# EAGLE design TwinSensorTestRevB (EAGLE 7.5.0)
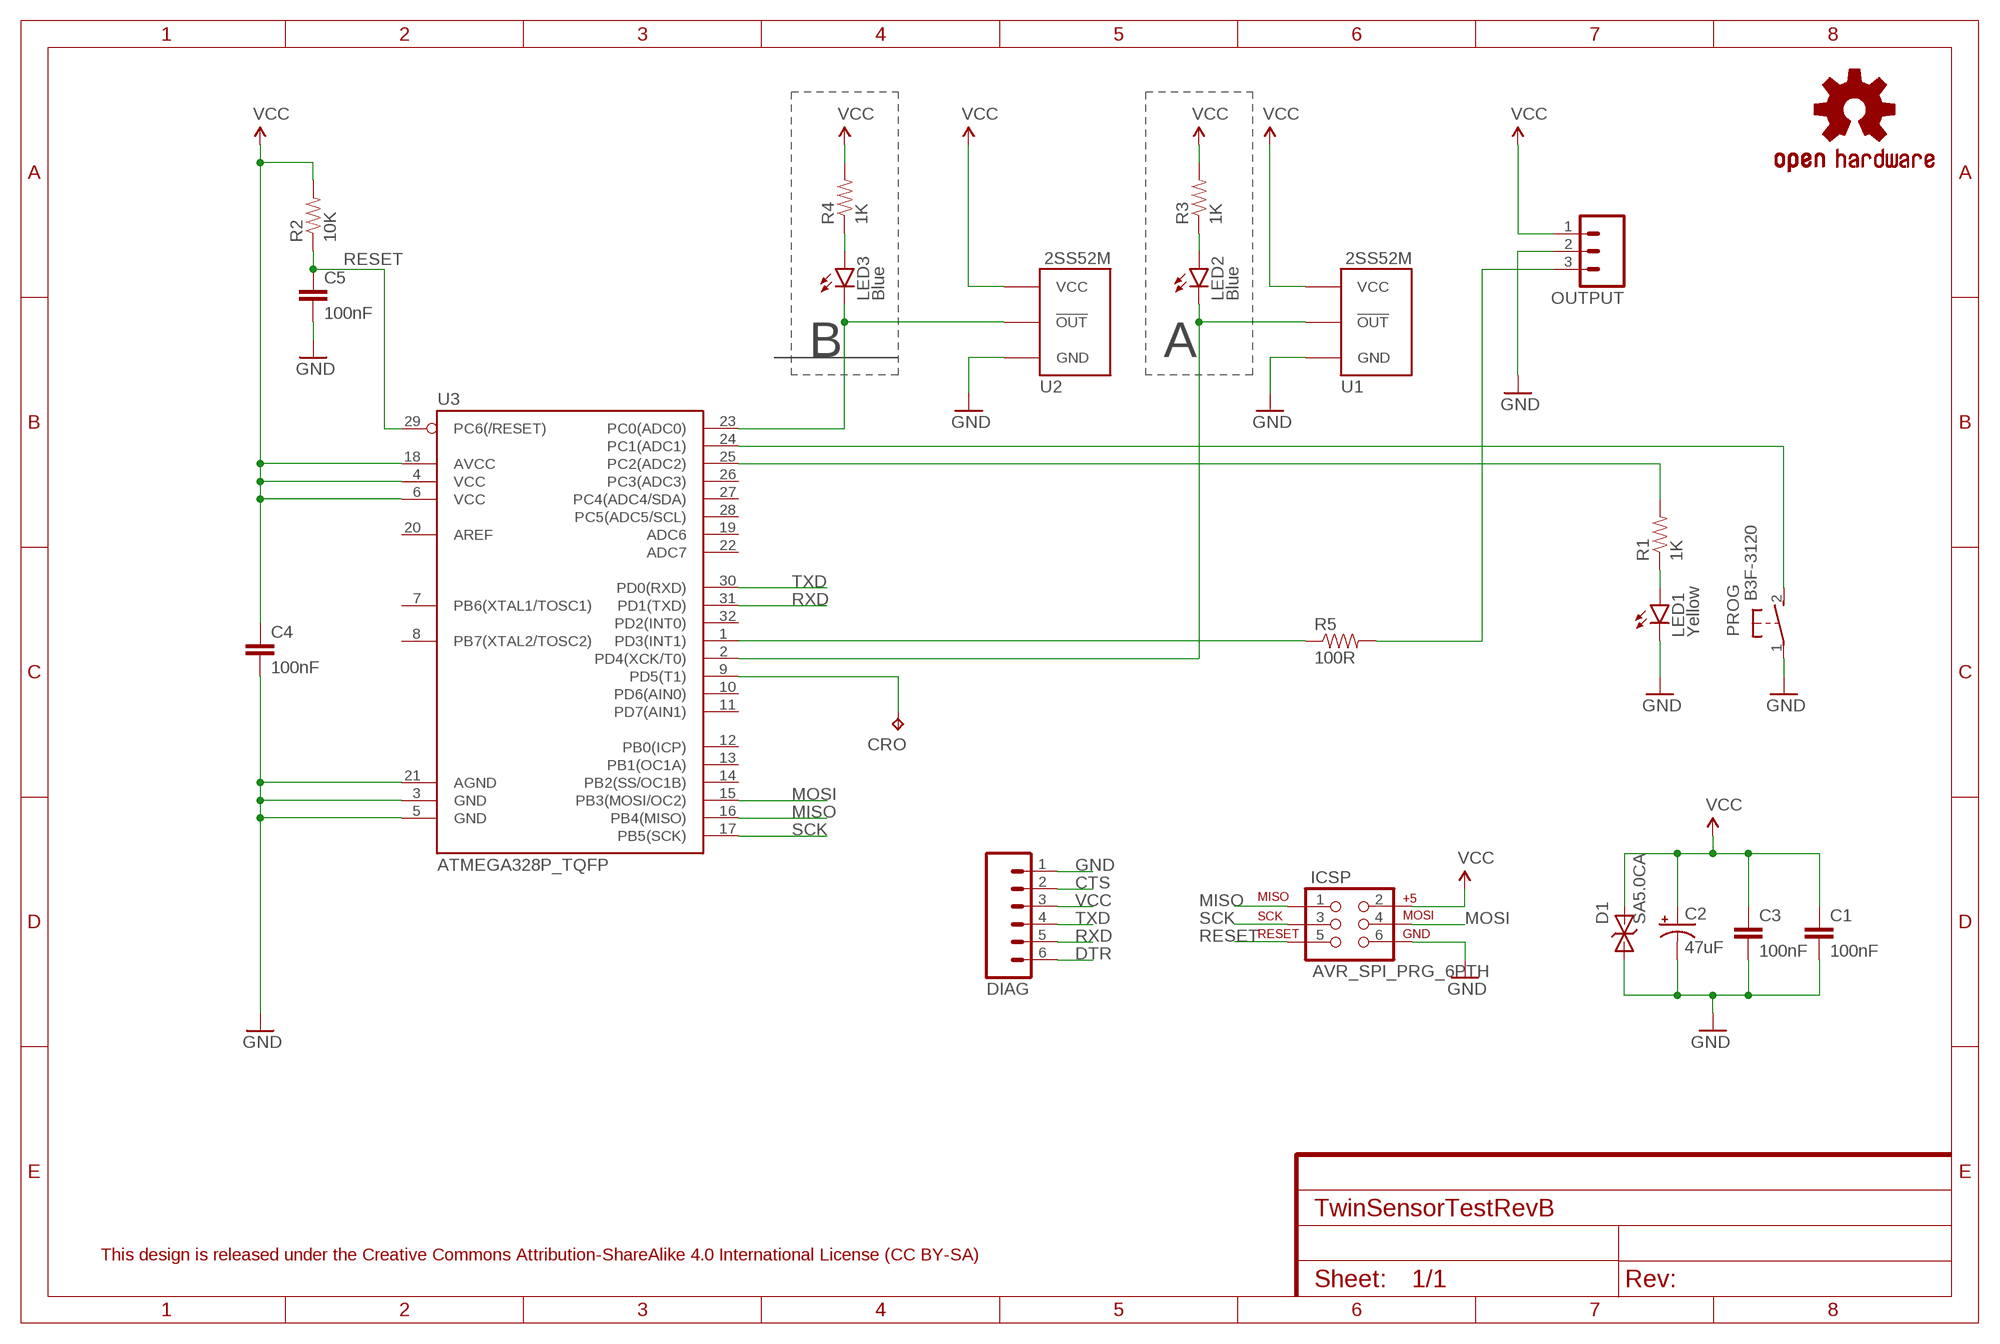
[diagram p0: schematic, sheet 1]
FRAME1 (FRAME-A4L): CNAME: Twin Sensor Test Board; CREVISION: B 05/2016; DESIGNER: Andrew Instone-Cowie

## Parts
C1  100nF  CAPPTH  [CAP-PTH-SMALL]
C2  47uF  CAP_POLPTH1  [CPOL-RADIAL-100UF-25V]
C3  100nF  CAPPTH  [CAP-PTH-SMALL]
C4  100nF  CAPPTH  [CAP-PTH-SMALL]
C5  100nF  CAPPTH  [CAP-PTH-SMALL]
CRO  TPTP10R  [TP10R]
D1  SA5.0CA  [DO41_TVS]
DIAG  M06SILK_FEMALE_PTH  [1X06]
ICSP  AVR_SPI_PRG_6PTH  [2X3]
LED1  Yellow  LED3MM  [LED3MM]
LED2  Blue  LED3MM  [LED3MM]
LED3  Blue  LED3MM  [LED3MM]
LOGO1  OSHW-LOGOS  [OSHW-LOGO-S]
OUTPUT  M03PTH  [1X03]
PROG  B3F-3120  [B3F-3120]
R1  1K  RESISTORPTH-1/4W  [AXIAL-0.4]
R2  10K  RESISTORPTH-1/4W  [AXIAL-0.4]
R3  1K  RESISTORPTH-1/4W  [AXIAL-0.4]
R4  1K  RESISTORPTH-1/4W  [AXIAL-0.4]
R5  100R  RESISTORPTH-1/4W  [AXIAL-0.4]
U1  2SS52MVERT  [2SS52M_VERT]
U2  2SS52MVERT  [2SS52M_VERT]
U3  ATMEGA328P_TQFP  [TQFP32-08]

## Nets
CTS: DIAG.2
DTR: DIAG.6
GND: C1.2 C2.2(-) C3.2 C4.2 C5.2 D1.A DIAG.1 ICSP.6 LED1.K(C) OUTPUT.2 PROG.1(P) U1.P$1(GND) U2.P$1(GND) U3.3(GND) U3.5(GND) U3.21(AGND)
MISO: ICSP.1 U3.16(PB4(MISO))
MOSI: ICSP.4 U3.15(PB3(MOSI/OC2))
N$1: LED2.A R3.P$1
N$2: LED3.A R4.P$1
N$3: R5.P$1 U3.1(PD3(INT1))
N$4: PROG.2(S) U3.24(PC1(ADC1))
N$5: R1.P$2 U3.25(PC2(ADC2))
N$6: LED1.A R1.P$1
N$7: LED2.K(C) U1.P$2(!OUT!) U3.2(PD4(XCK/T0))
N$8: LED3.K(C) U2.P$2(!OUT!) U3.23(PC0(ADC0))
N$9: CRO.TP U3.9(PD5(T1))
OUT: OUTPUT.3 R5.P$2
RESET: C5.1 ICSP.5 R2.P$1 U3.29(PC6(/RESET))
RXD: DIAG.5 U3.31(PD1(TXD))
SCK: ICSP.3 U3.17(PB5(SCK))
TXD: DIAG.4 U3.30(PD0(RXD))
VCC: C1.1 C2.1(+) C3.1 C4.1 D1.C DIAG.3 ICSP.2 OUTPUT.1 R2.P$2 R3.P$2 R4.P$2 U1.P$3(VCC) U2.P$3(VCC) U3.4(VCC) U3.6(VCC) U3.18(AVCC)
Unconnected: U3.7(PB6(XTAL1/TOSC1)) U3.8(PB7(XTAL2/TOSC2)) U3.10(PD6(AIN0)) U3.11(PD7(AIN1)) U3.12(PB0(ICP)) U3.13(PB1(OC1A)) U3.14(PB2(SS/OC1B)) U3.19(ADC6) U3.20(AREF) U3.22(ADC7) U3.26(PC3(ADC3)) U3.27(PC4(ADC4/SDA)) U3.28(PC5(ADC5/SCL)) U3.32(PD2(INT0))

## Notes on the sheet
- B | A
- This design is released under the Creative Commons Attribution-ShareAlike 4.0 International License (CC BY-SA)

## Library data of the parts
C1 C3-C5 = SparkFun-Passives:CAP: Capacitor Standard 0603 ceramic capacitor, and 0.1" leaded capacitor.
C2 = SparkFun-Passives:CAP_POL: Capacitor Polarized These are standard SMD and PTH capacitors. Normally 10uF, 47uF, and 100uF in electrolytic and tantalum varieties. Always verify the external diameter of the through hole cap, it varies with capacity, voltage, and manufacturer. The EIA devices should be standard.
CRO = testpad:TP: Test pad
D1 = AIC_Custom:SA5.0CA: SA5.0CA TVS Bi-Directional Transient Voltage Suppressor. 5V, DO41 package
DIAG = SparkFun-Connectors:M06: Header 6 Standard 6-pin 0.1" header. Use with straight break away headers (SKU : PRT-00116), right angle break away headers (PRT-00553), swiss pins (PRT-00743), machine pins (PRT-00117), and female headers (PRT-00115). Molex polarized connector foot print use with SKU : PRT-08094 with associated crimp pins and housings. NOTES ON THE VARIANTS LOCK and LOCK_LONGPADS... This footprint was designed to help hold the alignment of a through-hole component (i.e. 6-pin header) while soldering it into place. You may notice that each hole has been shifted either up or down by 0.005 of an inch from it's more standard position (which is a perfectly straight line). This slight alteration caused the pins (the squares in the middle) to touch the edges of the holes. Because they are alternating, it causes a "brace" to hold the component in place. 0.005 has proven to be the perfect amount of "off-center" position when using our standard breakaway headers. Although looks a little odd when you look at the bare footprint, once you have a header in there, the alteration is very hard to notice. Also,if you push a header all the way into place, it is covered up entirely on the bottom side. This idea of altering the position of holes to aid alignment will be further integrated into the Sparkfun Library for other footprints. It can help hold any component with 3 or more connection pins.; PROD_ID: CONN-08437
ICSP = SparkFun-Connectors:AVR_SPI_PRG_6: AVR ISP 6 Pin This is the reduced ISP connector for AVR programming. Common on Arduino. This footprint will take up less PCB space and can be used with a 10-pin to 6-pin adapter such as SKU: BOB-08508 **Special note about "TEST_POINT" package. The stop mask is on the top side, so if you want your programming test points to be on the bottom of your board, make sure to place this package on the bottom side of the board. This also ensure that the orientation to program from the bottom side will be correct.
LED1-LED3 = SparkFun-LED:LED: LEDs Standard schematic elements and footprints for 5mm, 3mm, 1206, and 0603 sized LEDs. 5mm - Spark Fun Electronics SKU : COM-00529 (and others)
LOGO1 = SparkFun-Aesthetics:OSHW-LOGO: Open Source Hardware Logo This logo indicates the piece of hardware it is found on incorporates a OSHW license and/or adheres to the definition of open source hardware found here: http://freedomdefined.org/OSHW
OUTPUT = SparkFun-Connectors:M03: Header 3 Standard 3-pin 0.1" header. Use with straight break away headers (SKU : PRT-00116), right angle break away headers (PRT-00553), swiss pins (PRT-00743), machine pins (PRT-00117), and female headers (PRT-00115). Molex polarized connector foot print use with SKU : PRT-08232 with associated crimp pins and housings.
PROG = AIC_Custom:B3F-3120: OMRON SWITCH; MPN: B3F-3100; OC_FARNELL: 959704; OC_NEWARK: 36M3582
R1-R5 = SparkFun-Passives:RESISTOR: Resistor Basic schematic elements and footprints for 0603, 1206, and PTH resistors.
U1 U2 = AIC_Custom:2SS52M: Honeywell 2SS52M Magnetoresistive Detector
U3 = SparkFun-DigitalIC:ATMEGA328P_TQFP; PROD_ID: IC-09069

## Board
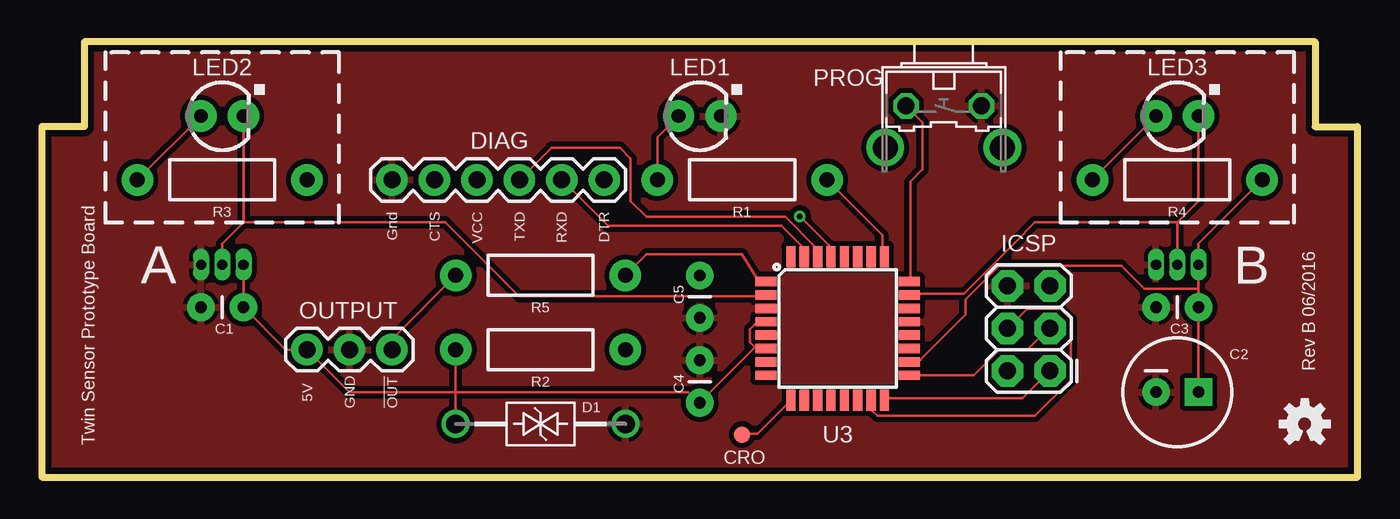
[diagram p1: board, top side]
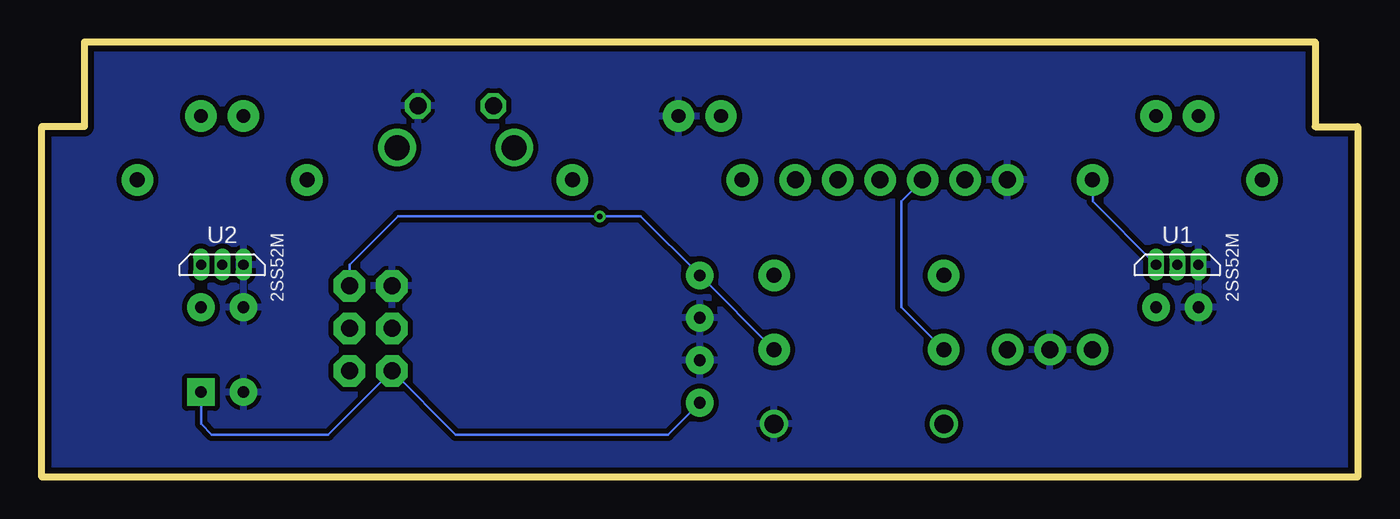
[diagram p2: board, bottom side, seen from below]

Size 78.74 x 26.04 mm. Coordinates in mm from the lower left corner, seen from the top.
Outline: 0,0 78.74,0 78.74,20.95 76.2,20.95 76.2,26.04 2.54,26.04 2.54,20.95 0,20.95 0,0
Copper layers (1*16): Top 0.0356mm / dielectric 1.5011mm / Bottom 0.0356mm
Design rules "LaenPCBOrder(OSHPARK)": minimum track width 6mil, minimum drill 13mil, track to track 6mil, track to pad 6mil, pad to pad 6mil, via to via 6mil, smd to smd 6mil, copper to edge 15mil, drill to drill 6mil, minimum pad ring 7mil, minimum via ring 7mil, stop-mask expansion 3mil, vias tented up to drill 0mil, thermal gap 10mil

### Footprints (pad centres in the part's own frame; a part is rotated, then mirrored left to right if it is on the bottom)
CAP-PTH-SMALL = drill 0.7 pad 1.651: 1 0,0; 2 2.54,0
CPOL-RADIAL-100UF-25V = drill 0.7 pad 1.651 square: 1 1.27,0 | drill 0.7 pad 1.651: 2 -1.27,0
TP10R = smd 1 x 1: TP 0,0
DO41_TVS = drill 1.118: A 5.08,0; C -5.08,0
1X06 = drill 1.016 pad 1.88: 1 0,0; 2 2.54,0; 3 5.08,0; 4 7.62,0; 5 10.16,0; 6 12.7,0
2X3 = drill 1.016 pad 1.88 octagon: 1 0,0; 2 0,2.54; 3 2.54,0; 4 2.54,2.54; 5 5.08,0; 6 5.08,2.54
LED3MM = drill 0.813 pad 1.88: A -1.27,0; K 1.27,0
1X03 = drill 1.016 pad 1.88: 1 0,0; 2 2.54,0; 3 5.08,0
B3F-3120 = drill 1.016 octagon: 1 -2.261,-1.245; 2 2.261,-1.245 | drill 1.499 pad 2.159: 3 -3.505,1.245; 4 3.505,1.245
AXIAL-0.4 = drill 0.9 pad 1.88: P$1 -5.08,0; P$2 5.08,0
2SS52M_VERT = drill 0.6 pad 0.813 long: P$1 0,1.27; P$2 0,0; P$3 0,-1.27
TQFP32-08 = smd 1.27 x 0.559: 1 -4.293,2.8; 2 -4.293,2; 3 -4.293,1.2; 4 -4.293,0.4; 5 -4.293,-0.4; 6 -4.293,-1.2; 7 -4.293,-2; 8 -4.293,-2.8; 17 4.293,-2.8; 18 4.293,-2; 19 4.293,-1.2; 20 4.293,-0.4; 21 4.293,0.4; 22 4.293,1.2; 23 4.293,2; 24 4.293,2.8 | smd 0.559 x 1.27: 9 -2.8,-4.293; 10 -2,-4.293; 11 -1.2,-4.293; 12 -0.4,-4.293; 13 0.4,-4.293; 14 1.2,-4.293; 15 2,-4.293; 16 2.8,-4.293; 25 2.8,4.293; 26 2,4.293; 27 1.2,4.293; 28 0.4,4.293; 29 -0.4,4.293; 30 -1.2,4.293; 31 -2,4.293; 32 -2.8,4.293

### Placement (x,y rotation side)
C1  12.06,10.16 180 top
C2  67.94,5.08 0 top
C3  69.22,10.16 180 top
C4  39.37,4.45 90 top
C5  39.37,12.06 270 top
CRO  41.91,2.54 0 top
D1  29.84,3.17 0 top
DIAG  20.95,17.78 0 top
ICSP  60.33,6.35 90 top
LED1  39.37,21.59 0 top
LED2  10.79,21.59 0 top
LED3  67.94,21.59 0 top
LOGO1  75.56,3.17 0 top
OUTPUT  15.88,7.62 0 top
PROG  53.98,20.95 180 top
R1  41.91,17.78 0 top
R2  29.84,7.62 180 top
R3  10.79,17.78 0 top
R4  67.94,17.78 0 top
R5  29.84,12.06 180 top
U1  10.79,12.7 270 bottom
U2  67.94,12.7 270 bottom
U3  47.62,8.89 0 top

### Tracks (layer width: path | path; a pad name or v marks a point on that pad's centre or on a via)
GND
  pour Bottom (isolate 0.305): 2.54,26.04 2.54,20.95 0,20.95 0,0 78.74,0 78.74,20.95 76.2,20.95 76.2,26.04
  pour Top (isolate 0.305): 2.54,26.04 2.54,20.95 0,20.95 0,0 78.74,0 78.74,20.95 76.2,20.95 76.2,26.04
MISO
  Top 0.152: U3.16 50.44,4.72 58.67,4.72 60.2,6.25 ICSP.1
MOSI
  Top 0.152: U3.15 49.68,4.57 49.68,3.96 49.99,3.66 59.44,3.66 61.57,5.79 61.57,9.45 60.96,10.06 58.98,10.06 57.91,8.99 ICSP.4
N$1
  Top 0.152: LED2.A R3.P$1
N$2
  Top 0.152: LED3.A R4.P$1
N$3
  Top 0.152: R5.P$1 36.2,13.34 41.91,13.34 42.92,11.69
  Top 0.406: 42.92,11.69 U3.1
N$4
  Top 0.152: U3.24 51.97,11.73 51.97,17.07 51.97,17.68 52.7,18.41 52.7,21.21 PROG.2
N$5
  Top 0.152: R1.P$2 50.29,14.48 50.29,13.26 U3.25
N$6
  Top 0.152: LED1.A 36.83,20.32 R1.P$1
N$7
  Top 0.152: U3.2 43.28,10.82 40.72,10.82 28.55,10.82 24.13,15.24 12.06,15.24 | LED2.K 12.06,15.24 | 12.06,15.24 10.79,13.97 U1.P$2
N$8
  Top 0.152: U3.23 51.97,10.97 55.17,10.97 58.22,14.02 59.44,15.24 67.94,15.24 | LED3.K 69.22,16.51 67.94,15.24 | 67.94,15.24 U2.P$2
N$9
  Top 0.152: CRO.TP 41.91,2.59 42.82,2.59 44.81,4.57 U3.9
OUT
  Top 0.152: R5.P$2 20.95,8.26 OUTPUT.3
RESET  (via drill 0.33)
  Top 0.152: v45.36,15.6 47.09,13.87 47.09,13.26 U3.29
  Bottom 0.152: R2.P$1 C5.1 42.9,15.6 v45.36,15.6 57.43,15.6 60.33,12.7 ICSP.5
RXD
  Top 0.152: U3.31 45.57,13.26 45.57,13.72 44.25,15.04 33.88,15.04 31.24,17.68 DIAG.5
SCK
  Top 0.152: U3.17 51.97,6.1 55.78,6.1 57.3,7.62 58.98,7.62 60.2,8.84 ICSP.3
TXD
  Top 0.152: U3.30 46.33,13.26 46.33,13.72 44.49,15.56 36.2,15.56 35.24,16.51 35.24,19.05 34.61,19.68 30.5,19.68 28.65,17.83 DIAG.4
VCC
  Top 0.152: 69.22,11.28 65.96,11.28 64.59,12.65 57.3,12.65 55.27,10.62 55.27,9.7 52.58,7.01 51.97,7.01 U3.18 | 42.67,7.77 43.28,7.77 U3.6 | 42.67,7.77 42.37,8.08 42.37,8.84 42.67,9.14 43.28,9.14 U3.4 | 42.67,7.77 39.47,4.57 C4.1 39.32,4.42 38.66,5.08 24.77,5.08 | R4.P$2 69.22,13.97 U2.P$3 69.22,11.28 | 69.22,11.28 C3.1 C2.1 | U1.P$3 C1.1 14.61,7.62 OUTPUT.1 18.41,5.08 24.77,5.08 | R2.P$2 24.77,5.08 | 24.77,5.08 D1.C
  Bottom 0.152: U1.P$3 15.85,16.48 15.85,17.75 R3.P$2 | DIAG.3 27.3,16.51 27.3,10.16 R2.P$2 | C2.1 69.22,3.17 68.58,2.54 61.59,2.54 ICSP.2 53.98,2.54 41.27,2.54 C4.1

### Text on the board
tPlace: Gnd / / CTS / / VCC / / TXD / / RXD / / DTR | A | B | Rev B 06/2016 | 5V / / GND / / !OUT! | Twin Sensor Prototype Board